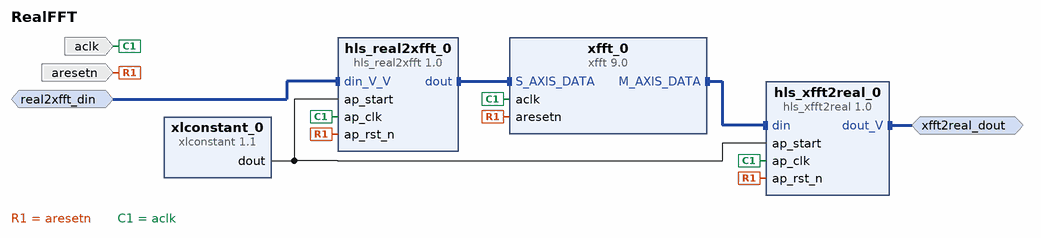
[diagram p0: block diagram of the top level]
# Vivado block design RealFFT, Vivado 2015.3
create_bd_design RealFFT

create_bd_intf_port -mode Slave -vlnv xilinx.com:interface:axis_rtl:1.0 real2xfft_din
set_property -dict [list \
  CONFIG.TDATA_NUM_BYTES 2 \
  CONFIG.TDEST_WIDTH 0 \
  CONFIG.TID_WIDTH 0 \
  CONFIG.TUSER_WIDTH 0 \
  CONFIG.HAS_TREADY 1 \
  CONFIG.HAS_TSTRB 0 \
  CONFIG.HAS_TKEEP 0 \
  CONFIG.HAS_TLAST 0 \
  CONFIG.FREQ_HZ 100000000 \
  CONFIG.PHASE 0.000 \
  CONFIG.LAYERED_METADATA {xilinx.com:interface:datatypes:1.0 {TDATA {datatype {name {attribs {resolve_type immediate dependency {} format string minimum {} maximum {}} value {}} bitwidth {attribs {resolve_type immediate dependency {} format long minimum {} maximum {}} value 16} bitoffset {attribs {resolve_type immediate dependency {} format long minimum {} maximum {}} value 0} real {fixed {fractwidth {attribs {resolve_type immediate dependency {} format long minimum {} maximum {}} value 15} signed {attribs {resolve_type immediate dependency {} format bool minimum {} maximum {}} value true}}}}}}} \
] [get_bd_intf_ports real2xfft_din]
create_bd_intf_port -mode Master -vlnv xilinx.com:interface:axis_rtl:1.0 xfft2real_dout
create_bd_port -dir I -type rst aresetn
create_bd_port -dir I -type clk aclk
set_property -dict {CONFIG.FREQ_HZ 100000000} [get_bd_ports aclk]

create_bd_cell -type ip -vlnv xilinx.com:hls:hls_xfft2real:1.0 hls_xfft2real_0
create_bd_cell -type ip -vlnv xilinx.com:hls:hls_real2xfft:1.0 hls_real2xfft_0
create_bd_cell -type ip -vlnv xilinx.com:ip:xfft:9.0 xfft_0
set_property -dict [list \
  CONFIG.transform_length 512 \
  CONFIG.implementation_options pipelined_streaming_io \
  CONFIG.aresetn true \
  CONFIG.number_of_stages_using_block_ram_for_data_and_phase_factors 2 \
] [get_bd_cells xfft_0]
create_bd_cell -type ip -vlnv xilinx.com:ip:xlconstant:1.1 xlconstant_0

# ---- connections ----

connect_bd_intf_net [get_bd_intf_pins hls_real2xfft_0/dout] [get_bd_intf_pins xfft_0/S_AXIS_DATA]
connect_bd_intf_net [get_bd_intf_pins hls_xfft2real_0/din] [get_bd_intf_pins xfft_0/M_AXIS_DATA]
connect_bd_intf_net [get_bd_intf_ports real2xfft_din] [get_bd_intf_pins hls_real2xfft_0/din_V_V]
connect_bd_intf_net [get_bd_intf_ports xfft2real_dout] [get_bd_intf_pins hls_xfft2real_0/dout_V]
connect_bd_net [get_bd_ports aresetn] [get_bd_pins xfft_0/aresetn] [get_bd_pins hls_real2xfft_0/ap_rst_n] [get_bd_pins hls_xfft2real_0/ap_rst_n]
connect_bd_net [get_bd_ports aclk] [get_bd_pins xfft_0/aclk] [get_bd_pins hls_real2xfft_0/ap_clk] [get_bd_pins hls_xfft2real_0/ap_clk]
connect_bd_net [get_bd_pins xlconstant_0/dout] [get_bd_pins hls_real2xfft_0/ap_start] [get_bd_pins hls_xfft2real_0/ap_start]

validate_bd_design
save_bd_design
